# Altium schematic sheet 频率-电压转换器.SchDoc
size A4
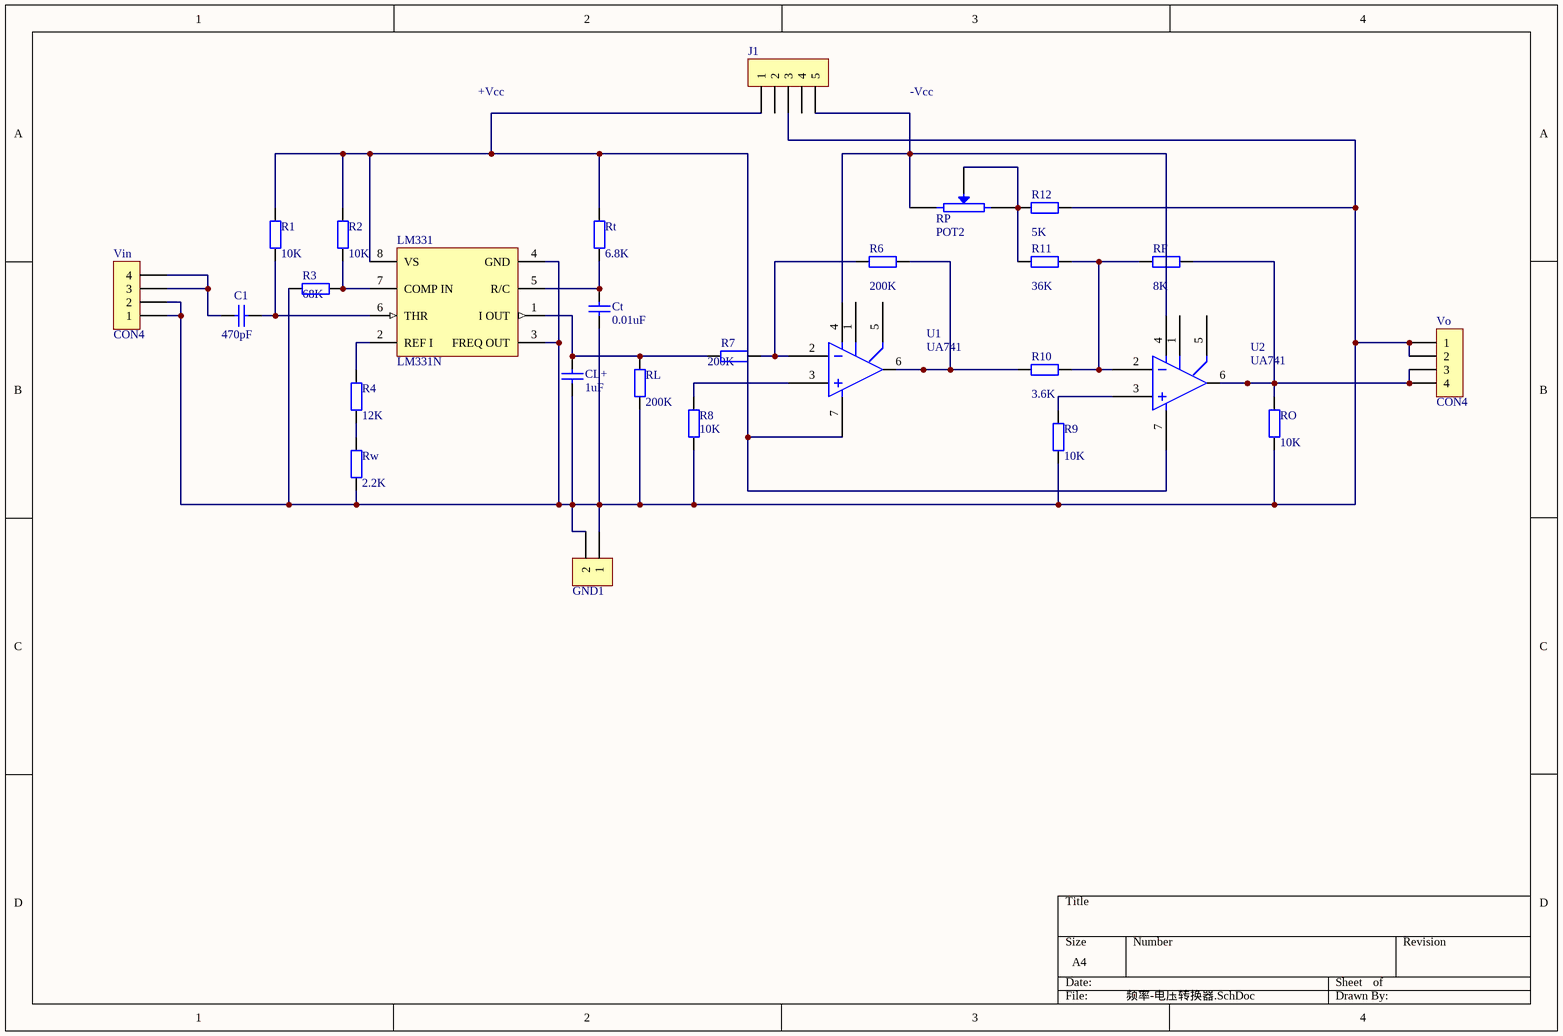
[diagram p0: 频率-电压转换器.SchDoc]

## Parts
C1  value 470pF  [RAD-0.2]  (hidden comment: Cap)
CL+  value 1uF  [RAD-0.2]  (hidden comment: Cap)
Ct  value 0.01uF  [RAD-0.2]  (hidden comment: Cap)
GND1  CON2  [SIP-2]  (value not drawn)
J1  CON5  [POWER PLUG5]  (value not drawn)
LM331  LM331N  [N08E]
R1  value 10K  [AXIAL-0.4]  (hidden comment: Res2)
R2  value 10K  [AXIAL-0.4]  (hidden comment: Res2)
R3  value 68K  [AXIAL-0.4]  (hidden comment: Res2)
R4  value 12K  [AXIAL-0.4]  (hidden comment: Res2)
R6  value 200K  [AXIAL-0.4]  (hidden comment: Res2)
R7  value 200K  [AXIAL-0.4]  (hidden comment: Res2)
R8  value 10K  [AXIAL-0.4]  (hidden comment: Res2)
R9  value 10K  [AXIAL-0.4]  (hidden comment: Res2)
R10  value 3.6K  [AXIAL-0.4]  (hidden comment: Res2)
R11  value 36K  [AXIAL-0.4]  (hidden comment: Res2)
R12  value 5K  [AXIAL-0.4]  (hidden comment: Res2)
RF  value 8K  [AXIAL-0.4]  (hidden comment: Res2)
RL  value 200K  [AXIAL-0.4]  (hidden comment: Res2)
RO  value 10K  [AXIAL-0.4]  (hidden comment: Res2)
RP  POT2  [RP3296]
Rt  value 6.8K  [AXIAL-0.4]  (hidden comment: Res2)
Rw  value 2.2K  [AXIAL-0.4]  (hidden comment: Res2)
U1  UA741  [DIP-8]
U2  UA741  [DIP-8]
Vin  CON4  [SIP-4]
Vo  CON4  [SIP-4]

## Nets
NetC1_1: C1.1 Vin.3 Vin.4
NetC1_2: C1.2 LM331.6(THR) R1.1
NetCL+_1: CL+.1 Ct.1 GND1.1 GND1.2 J1.3 LM331.3(FREQ_OUT) LM331.4(GND) R3.1 R8.2 R9.1 R12.1 RL.1 RO.2 Rw.1 Vin.1 Vin.2 Vo.1 Vo.2
NetCL+_2: CL+.2 LM331.1(I_OUT) R7.2 RL.2
NetCt_2: Ct.2 LM331.5(R/C) Rt.1
NetJ1_1: J1.1 LM331.8(VS) R1.2 R2.2 Rt.2 U1.7 U2.7
NetJ1_5: J1.5 RP.1 U1.4 U2.4
NetLM331_2: LM331.2(REF_I) R4.2
NetLM331_7: LM331.7(COMP_IN) R2.1 R3.2
NetR4_1: R4.1 Rw.2
NetR6_1: R6.1 R10.2 U1.6
NetR6_2: R6.2 R7.1 U1.2
NetR8_1: R8.1 U1.3
NetR9_2: R9.2 U2.3
NetR10_1: R10.1 R11.1 RF.2 U2.2
NetR11_2: R11.2 R12.2 RP.2 RP.3(W)
NetRF_1: RF.1 RO.1 U2.6 Vo.3 Vo.4

Not connected (* = marked no-connect by the designer): J1 2 4; U1 1 5; U2 1 5

## Notes on the sheet
- +Vcc
- -Vcc

## Library data of the parts
C1 CL+ Ct = Cap: Capacitor; Published: 8-Jun-2000; LatestRevisionDate: 17-Jul-2002; LatestRevisionNote: Re-released for DXP Platform.; PackageReference: RAD-0.3; Publisher: Altium Limited; PackageDescription: Radial Cap, Thru-Hole; 2 Leads; 0.3 in Pin Spacing
GND1 = CON2: Connector
J1 = CON5: Connector
LM331 = LM331N: Precision Voltage-to-Frequency Converters, 8-pin MDIP; Manufacturer: National Semiconductor; PackageTopMarking: NSUZXYTTE#*LM*331N; PowerWise: N; CompType: Analog IC; Published: 4-Dec-2008; DatasheetVersion: Apr-2006; PackageVersion: revG, May-2006; PackageReference: N08E; Publisher: Altium Limited; PackageDescription: MDIP, .365 x .250 x .130in, 8 Lead, .100in Pitch; Supplier 1: Farnell; Supplier Part Number 1: 9487751; PartNumber: LM331N; RoHS: N; PinCount: 8; Code_JEDEC: MS-001-BA; ComponentLink1Description: LM331 Datasheet; ComponentLink1URL: http://www.national.com/ds/LM/LM331.pdf; ComponentLink2Description: LM331 Web Page; ComponentLink2URL: http://www.national.com/pf/LM/LM331.html; ComponentLink3Description: N08E Package Page; ComponentLink3URL: http://www.national.com/packaging/folders/n08e.html
R1-R4 R6-R12 RF RL RO Rt Rw = Res2: Resistor; Published: 8-Jun-2000; LatestRevisionDate: 17-Jul-2002; LatestRevisionNote: Re-released for DXP Platform.; PackageReference: AXIAL-0.4; Publisher: Altium Limited; PackageDescription: Axial Device, Thru-Hole; 2 Leads; 0.4 in Pin Spacing
RP = POT2: Potentiometer
Vin Vo = CON4: Connector